# Altium project STM32F411CEU6.PrjPcb (part 2 of 3)
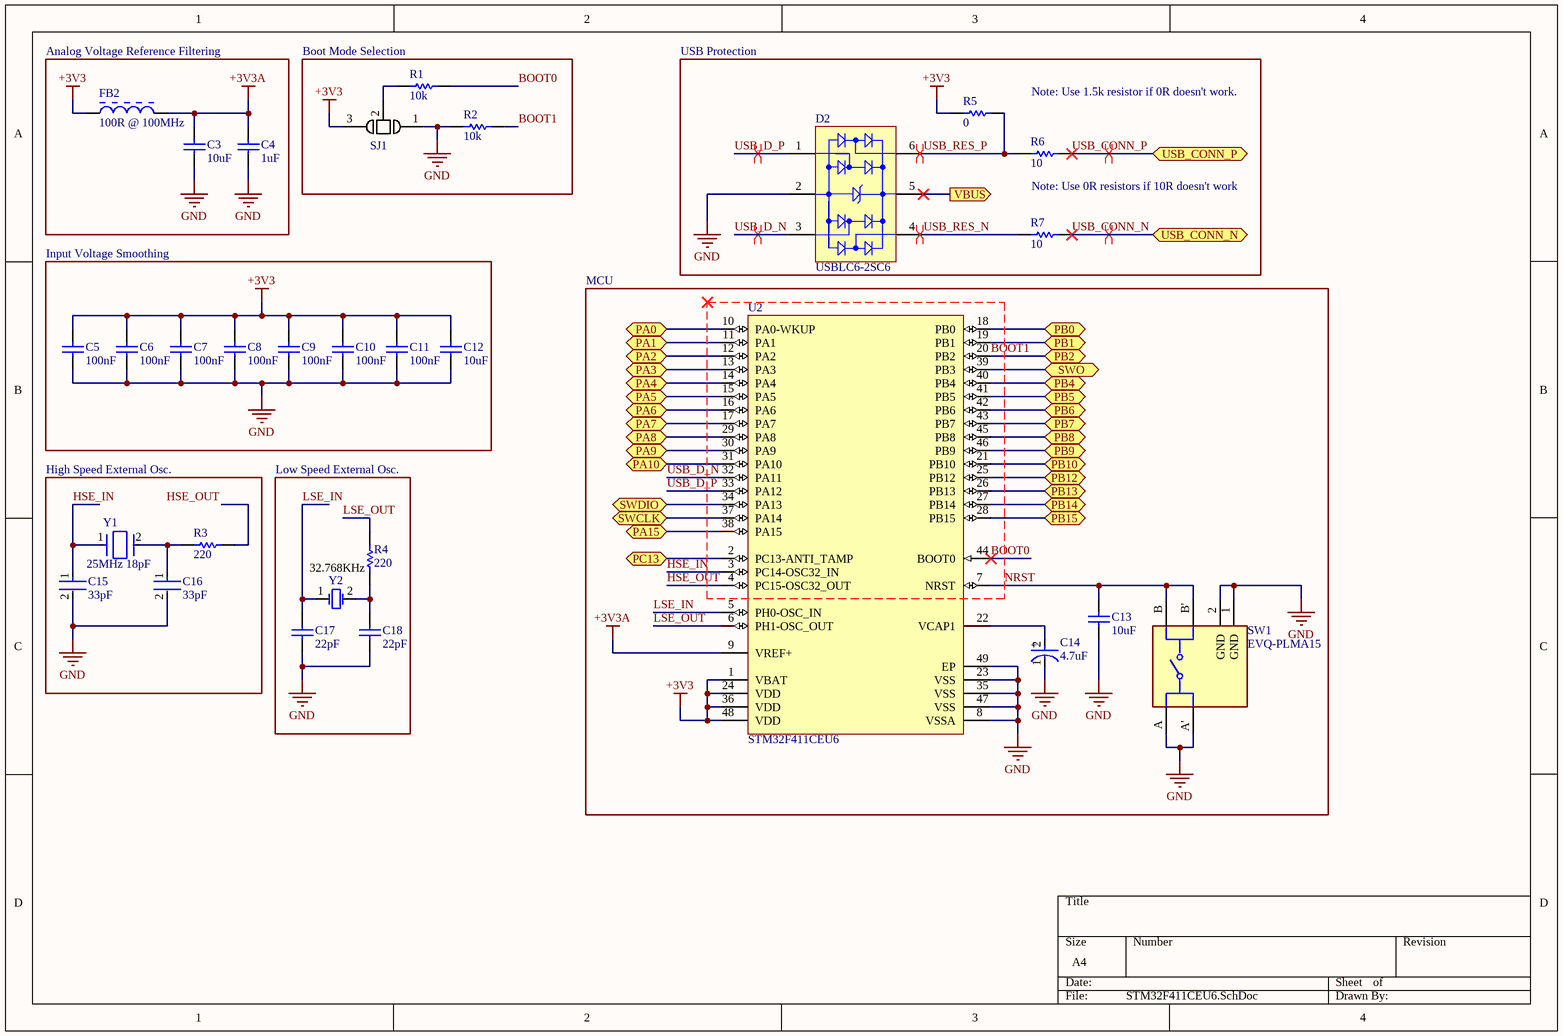
[diagram p1: STM32F411CEU6.SchDoc]

## Sheet STM32F411CEU6.SchDoc (continued)
### Library data of the parts
C3 C12 C13 = CMP-2000-06107-1: Chip Capacitor, 10 uF, +/- 10%, 25 V, -55 to 85 degC, 1206 (3216 Metric), RoHS, Tape and Reel; Manufacturer: Samsung Electro-Mechanics; Manufacturer Part Number: CL31A106KAHNNNE; Rated Voltage: 25V; Capacitance: 10µF; Dielectric: X5R; Material: Ceramic; Package Reference: 1206; Mounting Technology: SurfaceMount; Package Description: 2-Pin Surface Mount Device, Body 3.2 x 1.6 mm; Manufacturer URL: http://www.samsungsem.com/global/index.jsp; Case Size/Dimension: 1206; Datasheet URL: https://datasheet.ciiva.com/29201/452519-da-01-en-vs-kondensator-1206-29201124.pdf; Tolerance (%): ±10%; Datasheet Version: 11/2010; Supplier 1: Digi-Key; Supplier Part Number 1: 1276-1075-1-ND; RoHS: Yes; Category: Ceramic Capacitors; Stock 1: 396277; Pricing 1: 1=0.24000, 10=0.16500, 100=0.08360, 500=0.05720, 1000=0.05060 (USD); Mount: Surface Mount; Case/Package: 1206; Case Code (Metric): 3216; Case Code (Imperial): 1206; Contact Plating: Tin; Min Operating Temperature: -55°C; Max Operating Temperature: 85°C; Tolerance: 10%; Packaging: Tape and Reel; Voltage Rating (DC): 25V; Voltage Rating: 25V; Voltage: 25V; Length: 3.2mm; Height: 1.6mm; Width: 0.063inch; Depth: 1.6mm; Thickness: 0.071inch; Radiation Hardening: No; Lead Free: Lead Free; ComponentLink1URL: https://datasheet.ciiva.com/25710/cl31a106kahnnne-25710837.pdf?src-supplier=Digi-Key; ComponentLink1Description: https://datasheet.ciiva.com/25710/cl31a106kahnnne-25710837.pdf?src-supplier=Digi-Key; ComponentLink2URL: https://datasheet.ciiva.com/15195/getdatasheetpartid-355210-15195990.pdf?src-supplier=Verical; ComponentLink2Description: https://datasheet.ciiva.com/15195/getdatasheetpartid-355210-15195990.pdf?src-supplier=Verical; ComponentLink3URL: https://datasheet.ciiva.com/29201/452519-da-01-en-vs-kondensator-1206-29201124.pdf?src-supplier=Conrad; ComponentLink3Description: https://datasheet.ciiva.com/29201/452519-da-01-en-vs-kondensator-1206-29201124.pdf?src-supplier=Conrad; Supplier 2: LCSC; Supplier Part Number 2: C9807; Stock 2: 460; Pricing 2: 10=0.04400, 100=0.03140, 300=0.02920, 1000=0.02690, 5000=0.02540, 10000=0.02510, 10=0.04100, 100=0.02930, 300=0.02710, 1000=0.02500, 5000=0.02360, 10000=0.02340, 10=0.21300, 100=0.15210, 300=0.14120, 1000=0.13020, 5000=0.12290, 10000=0.12170, 10=0.19910, 100=0.14220, 300=0.13200, 1000=0.12170, 5000=0.11490, 10000=0.11380, 10=0.02670, 100=0.01910, 300=0.01770, 1000=0.01630, 5000=0.01540, 10000=0.01530, 10=0.02400, 100=0.01720, 300=0.01590, 1000=0.01470, 5000=0.01390, 10000=0.01370, 10=0.23290, 100=0.16630, 300=0.15440, 1000=0.14240, 5000=0.13440, 10000=0.13310, 10=3.22300, 100=2.30210, 300=2.13630, 1000=1.97060, 5000=1.86010, 10000=1.84170, 10=0.12870, 100=0.09190, 300=0.08530, 1000=0.07870, 5000=0.07430, 10000=0.07350, 10=2.09650, 100=1.49740, 300=1.38960, 1000=1.28180, 5000=1.21000, 10000=1.19800, 10=0.28100, 100=0.20070, 300=0.18620, 1000=0.17180, 5000=0.16220, 10000=0.16050, 10=0.04190, 100=0.02990, 300=0.02780, 1000=0.02560, 5000=0.02420, 10000=0.02390, 10=0.03005, 100=0.02146, 300=0.01992, 1000=0.01837, 5000=0.01734, 10000=0.01717 (AUD)
C4 = CMP-2007-03229-1: Part Number: C0805C105J4RACTU; Manufacturer: Kemet; Dielectric Material: Ceramic; Tolerance: 5%; Voltage Rating (DC): 16V; Dielectric: X7R; Supplier 1: Digi-Key; Supplier Part Number 1: 399-8001-1-ND; Manufacturer Part Number: C0805C105J4RACTU; RoHS: Yes; Category: Ceramic Capacitors; Stock 1: 85192; Pricing 1: 1=0.36000, 10=0.25000, 100=0.15030, 500=0.11272, 1000=0.09518 (USD); Mount: Surface Mount; Case/Package: 0805; Number of Pins: 2; Case Code (Imperial): 0805; Case Code (Metric): 2012; Min Operating Temperature: -55°C; Max Operating Temperature: 125°C; Capacitance: 1uF; Packaging: Tape and Reel; Package Quantity: 1; Termination: SMD/SMT; Voltage Rating: 16V; Length: 2mm; Height: 0.9mm; Width: 0.049inch; Thickness: 0.039inch; Depth: 1.25mm; Lead Pitch: 0.75mm; REACH SVHC: No SVHC; ComponentLink1URL: http://components.arrow.com/part/dataview/30748390S8976888N7429?src-supplier=Arrow; ComponentLink1Description: http://components.arrow.com/part/dataview/30748390S8976888N7429?src-supplier=Arrow; ComponentLink2URL: http://components.arrow.com/part/dataview/0323_00070888?src-supplier=Arrow+Europe; ComponentLink2Description: http://components.arrow.com/part/dataview/0323_00070888?src-supplier=Arrow+Europe; ComponentLink3URL: http://www.farnell.com/datasheets/2746093.pdf?src-supplier=Farnell; ComponentLink3Description: http://www.farnell.com/datasheets/2746093.pdf?src-supplier=Farnell; ComponentLink4URL: http://www.mouser.com/ds/2/212/KEM_C1002_X7R_SMD-1102033.pdf?src-supplier=Mouser; ComponentLink4Description: http://www.mouser.com/ds/2/212/KEM_C1002_X7R_SMD-1102033.pdf?src-supplier=Mouser; ComponentLink5URL: http://www.farnell.com/datasheets/2315440.pdf?src-supplier=Farnell; ComponentLink5Description: http://www.farnell.com/datasheets/2315440.pdf?src-supplier=Farnell; ComponentLink6URL: http://capacitoredge.kemet.com/capedge2/DataSheet?pn=C0805C105J4RACTU&src-supplier=Avnet; ComponentLink6Description: http://capacitoredge.kemet.com/capedge2/DataSheet?pn=C0805C105J4RACTU&src-supplier=Avnet; ComponentLink7URL: http://www.farnell.com/datasheets/1828800.pdf?src-supplier=Element14; ComponentLink7Description: http://www.farnell.com/datasheets/1828800.pdf?src-supplier=Element14; ComponentLink8URL: http://www.farnell.com/datasheets/1828800.pdf?src-supplier=Newark; ComponentLink8Description: http://www.farnell.com/datasheets/1828800.pdf?src-supplier=Newark; ComponentLink9URL: http://www.farnell.com/datasheets/2746093.pdf?src-supplier=Element14; ComponentLink9Description: http://www.farnell.com/datasheets/2746093.pdf?src-supplier=Element14; ComponentLink10URL: https://api.kemet.com/component-edge/download/datasheet/C0805C105J4RACTU.pdf?src-supplier=Digi-Key; ComponentLink10Description: https://api.kemet.com/component-edge/download/datasheet/C0805C105J4RACTU.pdf?src-supplier=Digi-Key; ComponentLink11URL: http://www.farnell.com/datasheets/2746093.pdf?src-supplier=Newark; ComponentLink11Description: http://www.farnell.com/datasheets/2746093.pdf?src-supplier=Newark; ComponentLink12URL: http://capacitoredge.kemet.com/capedge2/DataSheet?pn=C0805C105J4RACTU&src-supplier=Avnet+Europe; ComponentLink12Description: http://capacitoredge.kemet.com/capedge2/DataSheet?pn=C0805C105J4RACTU&src-supplier=Avnet+Europe
C5-C11 = CMP-2000-05808-1: Chip Capacitor, 0.1 uF, +/- 5%, 50 V, -55 to 125 degC, 0805 (2012 Metric), RoHS, Tape and Reel; Manufacturer Part Number: 08055C104JAT2A; Case Width: 1.25mm; Case Length: 2.01mm; Case Height: 0.94mm; Capacitance: 0.1uF; Brand: AVX; Type: StandardX7RMLCCs; Dissipation Factor DF: 2.5; Voltage Rating DC: 50V; Temperature Coefficient / Code: +/-15%; Capacitance - pF: 100000pF; Dielectric: X7R; Dielectric Material: Ceramic; Dissipation Factor: 2.5%; Insulation Resistance: 100GR; Dimensions: 1.25mmWx2.01mmLx0.94mmH; Product: GeneralTypeMLCCs; Package Description: 2-Pin Surface Mount Device, Body 2.01 x 1.25 mm; Package / Case: 0805(2012metric); Product Category: MultilayerCeramicCapacitorsMLCC-SMD/SMT; Case Code - mm: 2012; Packaging: Reel; Manufacturer URL: http://www.avx.com/; Operating Temperature Range: -55Cto+125C; Termination Style: SMD/SMT; Maximum Operating Temperature: +125C; Capacitance - nF: 100nF; Case Code - in: 0805; Minimum Operating Temperature: -55C; Factory Pack Quantity: 4000; RoHS: Details; Voltage Rating: 50V; Tolerance: 5%; Package Reference: 0805; Datasheet URL: http://www.farnell.com/datasheets/1679506.pdf; Manufacturer: AVX; Mounting Technology: SurfaceMount; Datasheet Version: 11/2012; Supplier 1: Digi-Key; Supplier Part Number 1: 478-3352-1-ND; Category: Ceramic Capacitors; Stock 1: 1860909; Pricing 1: 1=0.24000, 10=0.16500, 100=0.08360, 500=0.05722, 1000=0.05063 (USD); Mount: Surface Mount,PCB; Case/Package: 0805; Number of Pins: 2; Case Code (Metric): 2012; Case Code (Imperial): 0805; Contact Plating: Tin,Matte; Min Operating Temperature: -55°C; Max Operating Temperature: 125°C; Package Quantity: 1; Voltage Rating (DC): 50V; Termination: SMD/SMT; Voltage: 50V; Length: 2.01mm; Height: 0.94mm; Width: 0.049inch; Thickness: 0.037inch; Depth: 1.25mm; Radiation Hardening: No; REACH SVHC: No SVHC; Lead Free: Lead Free; ComponentLink1URL: https://datasheet.ciiva.com/27054/1929381-27054902.pdf?src-supplier=Jameco; ComponentLink1Description: https://datasheet.ciiva.com/27054/1929381-27054902.pdf?src-supplier=Jameco; ComponentLink2URL: https://datasheet.ciiva.com/150/cx7r-150563.pdf?src-supplier=Digi-Key; ComponentLink2Description: https://datasheet.ciiva.com/150/cx7r-150563.pdf?src-supplier=Digi-Key; ComponentLink3URL: https://datasheet.ciiva.com/150/cx7r-150564.pdf?src-supplier=Digi-Key; ComponentLink3Description: https://datasheet.ciiva.com/150/cx7r-150564.pdf?src-supplier=Digi-Key; ComponentLink4URL: https://datasheet.ciiva.com/150/cx7r-150565.pdf?src-supplier=Digi-Key; ComponentLink4Description: https://datasheet.ciiva.com/150/cx7r-150565.pdf?src-supplier=Digi-Key; ComponentLink5URL: https://datasheet.ciiva.com/28683/cx7r-28683529.pdf?src-supplier=Element14; ComponentLink5Description: https://datasheet.ciiva.com/28683/cx7r-28683529.pdf?src-supplier=Element14; ComponentLink6URL: https://datasheet.ciiva.com/7812/cx7r-7812074.pdf?src-supplier=Element14; ComponentLink6Description: https://datasheet.ciiva.com/7812/cx7r-7812074.pdf?src-supplier=Element14; ComponentLink7URL: https://datasheet.ciiva.com/7812/cx7r-7812075.pdf?src-supplier=Element14; ComponentLink7Description: https://datasheet.ciiva.com/7812/cx7r-7812075.pdf?src-supplier=Element14; ComponentLink8URL: https://datasheet.ciiva.com/15212/getdatasheetpartid-110198-15212571.pdf?src-supplier=Verical; ComponentLink8Description: https://datasheet.ciiva.com/15212/getdatasheetpartid-110198-15212571.pdf?src-supplier=Verical; ComponentLink9URL: https://datasheet.ciiva.com/7812/cx7r-7812076.pdf?src-supplier=Element14; ComponentLink9Description: https://datasheet.ciiva.com/7812/cx7r-7812076.pdf?src-supplier=Element14; ComponentLink10URL: https://datasheet.ciiva.com/14590/70001075-14590237.pdf?src-supplier=Allied+Electronics; ComponentLink10Description: https://datasheet.ciiva.com/14590/70001075-14590237.pdf?src-supplier=Allied+Electronics; ComponentLink11URL: https://datasheet.ciiva.com/16199/cx5r-16199661.pdf?src-supplier=Future+Electronics; ComponentLink11Description: https://datasheet.ciiva.com/16199/cx5r-16199661.pdf?src-supplier=Future+Electronics
C14 = CMP-04423-000002-1: CAP TANT POLY 4.7UF 10V SMD; Manufacturer Part Number: F381A475MMA; Manufacturer: AVX; Tolerance: 20%; Esr: 500mΩ; Material: Tantalum-Polymer; Ripple Current: 224mA; Dissipation Factor: 6%; Life: 1000Hours; Leakage Current: 10uA; ESR (Equivalent Series Resistance): 500mR; Package: F38M; Temperature Range High: +105°C; Temperature: -55°C to +105°C; ComponentLink2URL: http://datasheets.avx.com/F38.pdf; Mouser Description: Tantalum Capacitors - Polymer SMD 10volts 4.7uF 20%; Device Class L3: Polymer Capacitors; Lead Free: Yes; Temperature Range Low: -55°C; RoHS: TRUE; Capacitance: 4.7uF; Category: Cap; Footprint Url: http://www.avx.com/download/software/literature/AVX-Footprint-Library.pdf; Device Class L1: Passive Components; Voltage Rating: 10V; Octopart: https://octopart.com/f381a475mma-avx-30375031; ComponentLink2Description: Datasheet; Automotive: No; Digikey Description: CAP TANT POLY 4.7UF 10V SMD; Height: 0.9mm; Device Class L2: Capacitors; Value: 4.7uF; Supplier 1: Digi-Key; Supplier Part Number 1: 478-8726-1-ND; Stock 1: 1198; Pricing 1: 1=0.68000, 10=0.50200, 100=0.34440, 500=0.27268, 1000=0.22963 (USD); Mount: Surface Mount; Case/Package: 0603; Case Code (Metric): 1608; Case Code (Imperial): 0603; Min Operating Temperature: -55°C; Max Operating Temperature: 105°C; Voltage Rating (DC): 10V; Packaging: Cut Tape; Termination: SMD/SMT; Package Quantity: 1; Length: 1.6mm; Height - Seated (Max): 0.035inch; Width: 0.033inch; Depth: 0.85mm; Radiation Hardening: No; REACH SVHC: No SVHC; ComponentLink1URL: https://datasheet.ciiva.com/29504/f38-29504935.pdf?src-supplier=Digi-Key; ComponentLink1Description: https://datasheet.ciiva.com/29504/f38-29504935.pdf?src-supplier=Digi-Key; ComponentLink3URL: https://datasheet.ciiva.com/29897/f38-29897863.pdf?src-supplier=Avnet; ComponentLink3Description: https://datasheet.ciiva.com/29897/f38-29897863.pdf?src-supplier=Avnet; ComponentLink4URL: https://datasheet.ciiva.com/29504/f38-29504936.pdf?src-supplier=Digi-Key; ComponentLink4Description: https://datasheet.ciiva.com/29504/f38-29504936.pdf?src-supplier=Digi-Key; ComponentLink5URL: https://datasheet.ciiva.com/29504/f38-29504937.pdf?src-supplier=Digi-Key; ComponentLink5Description: https://datasheet.ciiva.com/29504/f38-29504937.pdf?src-supplier=Digi-Key; ComponentLink6URL: https://datasheet.ciiva.com/24040/f38-24040542.pdf?src-supplier=Mouser; ComponentLink6Description: https://datasheet.ciiva.com/24040/f38-24040542.pdf?src-supplier=Mouser
C15 C16 = CMP-13271-001471-1: Cap Ceramic 33pF 50V C0G ±5% SMD 0402 +125°C Paper T/R; Manufacturer: Samsung; Manufacturer Part Number: CL05C330JB5NNNC; Temperature Coefficient: 300ppm/°C; Dielectric: C0G; Height: 0.5mm; Tolerance: 5%; Package Quantity: 1; Mount: Surface Mount; Material: Ceramic; Min Operating Temperature: -55°C; Thickness: 0.022inch; Voltage Rating (DC): 50V; Case/Package: 0402; Width: 0.02inch; Depth: 0.5mm; Lead Free: Lead Free; Max Operating Temperature: 125°C; Voltage: 50V; Case Code (Metric): 1005; Capacitance: 33pF; Case Code (Imperial): 0402; Packaging: Tape and Reel; Voltage Rating: 50V; Contact Plating: Tin; Radiation Hardening: No; Length: 1mm; Supplier 1: LCSC; Supplier Part Number 1: C70465; RoHS: Yes; Category: Ceramic Capacitors; Stock 1: 118300; Pricing 1: 100=0.00330, 1000=0.00240, 3000=0.00230, 10000=0.00210, 50000=0.00210, 100000=0.00200, 100=0.00310, 1000=0.00230, 3000=0.00220, 10000=0.00200, 50000=0.00200, 100000=0.00190, 100=0.01640, 1000=0.01220, 3000=0.01140, 10000=0.01060, 50000=0.01030, 100000=0.01010, 100=0.01490, 1000=0.01110, 3000=0.01040, 10000=0.00970, 50000=0.00930, 100000=0.00920, 100=0.00200, 1000=0.00150, 3000=0.00140, 10000=0.00130, 50000=0.00130, 100000=0.00120, 100=0.00180, 1000=0.00140, 3000=0.00130, 10000=0.00120, 50000=0.00110, 100000=0.00110, 100=0.01810, 1000=0.01350, 3000=0.01260, 10000=0.01180, 50000=0.01140, 100000=0.01120, 100=0.24740, 1000=0.18370, 3000=0.17200, 10000=0.16030, 50000=0.15520, 100000=0.15250, 100=0.01000, 1000=0.00740, 3000=0.00690, 10000=0.00650, 50000=0.00620, 100000=0.00610, 100=0.16780, 1000=0.12460, 3000=0.11660, 10000=0.10870, 50000=0.10520, 100000=0.10340, 100=0.02060, 1000=0.01530, 3000=0.01430, 10000=0.01340, 50000=0.01290, 100000=0.01270, 100=0.00320, 1000=0.00240, 3000=0.00220, 10000=0.00210, 50000=0.00200, 100000=0.00200, 100=0.00234, 1000=0.00174, 3000=0.00163, 10000=0.00152, 50000=0.00147, 100000=0.00144 (AUD); ComponentLink1URL: https://datasheet.ciiva.com/15195/getdatasheetpartid-355282-15195687.pdf?src-supplier=Verical; ComponentLink1Description: https://datasheet.ciiva.com/15195/getdatasheetpartid-355282-15195687.pdf?src-supplier=Verical; ComponentLink2URL: https://datasheet.ciiva.com/29198/458594-da-01-en-vs-kondensator-0402-29198402.pdf?src-supplier=Conrad; ComponentLink2Description: https://datasheet.ciiva.com/29198/458594-da-01-en-vs-kondensator-0402-29198402.pdf?src-supplier=Conrad; Supplier 2: Digi-Key; Supplier Part Number 2: 1276-1272-1-ND; Stock 2: 9451353; Pricing 2: 1=0.10000, 10=0.02700, 50=0.01460, 100=0.01200, 500=0.00854, 1000=0.00672, 2500=0.00610, 5000=0.00562 (USD)
C17 C18 = CMP-2007-00048-1: Manufacturer: Kemet; Part Number: C0805C220J5GACTU; Dielectric Material: Ceramic; Tolerance: 5%; Dielectric: C0G; Voltage Rating: 50V; Temperature Coefficient: 30ppm/°C; Supplier 1: Digi-Key; Supplier Part Number 1: 399-1113-1-ND; Manufacturer Part Number: C0805C220J5GACTU; RoHS: Yes; Category: Ceramic Capacitors; Stock 1: 508600; Pricing 1: 1=0.10000, 10=0.07000, 100=0.03100, 500=0.02214, 1000=0.01739 (USD); Mount: PCB,Surface Mount; Case/Package: 0805; Weight: 0.000194oz; Case Code (Metric): 2012; Case Code (Imperial): 0805; Contact Plating: Tin,Matte; Contact Material: Tin; Min Operating Temperature: -55°C; Max Operating Temperature: 125°C; Packaging: Tape and Reel; Capacitance: 22pF; Voltage Rating (DC): 50V; Package Quantity: 1; Termination: SMD/SMT; Voltage: 50V; Length: 2mm; Height: 0.78mm; Width: 1.25mm; Depth: 1.25mm; Thickness: 0.035inch; Radiation Hardening: No; REACH SVHC: No SVHC; Lead Free: Lead Free; ComponentLink1URL: https://datasheet.ciiva.com/7842/1732694-7842250.pdf?src-supplier=Element14; ComponentLink1Description: https://datasheet.ciiva.com/7842/1732694-7842250.pdf?src-supplier=Element14; ComponentLink2URL: https://datasheet.ciiva.com/7842/kem-c1003-c0g-smd-7842569.pdf?src-supplier=Element14; ComponentLink2Description: https://datasheet.ciiva.com/7842/kem-c1003-c0g-smd-7842569.pdf?src-supplier=Element14; ComponentLink3URL: https://datasheet.ciiva.com/28668/1789732-28668761.pdf?src-supplier=Element14; ComponentLink3Description: https://datasheet.ciiva.com/28668/1789732-28668761.pdf?src-supplier=Element14; ComponentLink4URL: https://datasheet.ciiva.com/7842/1372242-7842570.pdf?src-supplier=Element14; ComponentLink4Description: https://datasheet.ciiva.com/7842/1372242-7842570.pdf?src-supplier=Element14; ComponentLink5URL: https://datasheet.ciiva.com/7842/1732694-7842251.pdf?src-supplier=Element14; ComponentLink5Description: https://datasheet.ciiva.com/7842/1732694-7842251.pdf?src-supplier=Element14
D2 = CMP-2000-05378-1: Very low capacitance ESD protection, 3.5 pF, -40 to 125 degC, 6-Pin SOT23, RoHS, Tape and Reel; Manufacturer: STMicroelectronics; Polarity: Uni-Directional; Clamping Voltage: 17V; Rad Hardened: No; Product Height (mm): 1.3mm; Leakage Current (Max): 0.15uA; Product Length (mm): 3.05mm; Number of Elements: 1; Peak Pulse Current: 5A; Configuration: Dual; Reverse Breakdown Voltage: 6V; Working Voltage (Max): 5V; Capacitance Value: 3.5pF; Suppressor Type: DiodeArrays; Product Depth (mm): 1.75mm; Test Current (It): 1mA; Data Rate: 480Mbps; Direction: Unidirectional,Bidirectional; Operating Supply Voltage: 1.1V; Number of Channels: 2; Reverse Standoff Voltage: 5.25V; Power Line Protection: Yes; Max Reverse Leakage Current: 150nA; Package / Case: SOT-23; Operating Temperature Max Deg. C: 125C; Package Description: 6-Pin Small Outline Transistor, Body 2.925 x 1.625 mm, Pitch 0.95 mm; Package Reference: SOT23-6L; Datasheet Version: Rev. 5, 10/2011; Operating Temperature Min Deg. C: -40C; Mounting Style: SurfaceMount; Direction Type: Uni-Directional; Mounting: SurfaceMount; Pin Count: 6; Leakage Current: 0.15uA; Packaging: TapeandReel; Operating Temperature Classification: Automotive; Clamping Voltage (Max): 17V; Manufacturer URL: http://www.st.com/; Reverse Stand-off Voltage: 5V; Datasheet URL: http://www.st.com/st-web-ui/static/active/en/resource/technical/document/datasheet/CD00050750.pdf; Working Voltage: 5V; Operating Temp Range: -40Cto125C; Supplier 1: LCSC; Supplier Part Number 1: C7519; Manufacturer Part Number: USBLC6-2SC6; RoHS: Yes; Category: TVS Diodes; Stock 1: 134230; Pricing 1: 5=0.11390, 50=0.08290, 150=0.07720, 500=0.07160, 2500=0.06900, 5000=0.06780, 5=0.10900, 50=0.07940, 150=0.07400, 500=0.06850, 2500=0.06610, 5000=0.06490, 5=0.57160, 50=0.41630, 150=0.38780, 500=0.35930, 2500=0.34660, 5000=0.34030, 5=0.51650, 50=0.37620, 150=0.35040, 500=0.32460, 2500=0.31320, 5000=0.30750, 5=0.06940, 50=0.05050, 150=0.04710, 500=0.04360, 2500=0.04210, 5000=0.04130, 5=0.06290, 50=0.04580, 150=0.04270, 500=0.03960, 2500=0.03820, 5000=0.03750, 5=0.63310, 50=0.46110, 150=0.42950, 500=0.39790, 2500=0.38390, 5000=0.37700, 5=8.58430, 50=6.25210, 150=5.82360, 500=5.39530, 2500=5.20490, 5000=5.11090, 5=0.34660, 50=0.25240, 150=0.23510, 500=0.21780, 2500=0.21010, 5000=0.20630, 5=5.93360, 50=4.32150, 150=4.02540, 500=3.72930, 2500=3.59770, 5000=3.53270, 5=0.71370, 50=0.51980, 150=0.48420, 500=0.44860, 2500=0.43270, 5000=0.42490, 5=0.11230, 50=0.08180, 150=0.07620, 500=0.07060, 2500=0.06810, 5000=0.06690, 5=0.08169, 50=0.05950, 150=0.05542, 500=0.05135, 2500=0.04953, 5000=0.04864 (AUD); Mount: Surface Mount; Case/Package: SOT-23; Number of Pins: 6; Contact Plating: Tin,Matte; Min Operating Temperature: -40°C; Max Operating Temperature: 125°C; Capacitance: 3.5pF; Package Quantity: 3000; Breakdown Voltage: 6V; Termination: SMD/SMT; Number of Bidirectional Channels: 2; Min Breakdown Voltage: 6V; ESD Protection: Yes; Test Current: 1mA; Max Breakdown Voltage: 6V; Element Configuration: Dual; Length: 3.05mm; Height: 1.3mm; Width: 1.75mm; Depth: 1.75mm; Radiation Hardening: No; REACH SVHC: No SVHC; Lead Free: Lead Free; ComponentLink1URL: https://datasheet.ciiva.com/1268/1690354-1268384.pdf?src-supplier=Element14; ComponentLink1Description: https://datasheet.ciiva.com/1268/1690354-1268384.pdf?src-supplier=Element14; ComponentLink2URL: https://datasheet.ciiva.com/4508/cd00050750-113117-4508433.pdf?src-supplier=Mouser; ComponentLink2Description: https://datasheet.ciiva.com/4508/cd00050750-113117-4508433.pdf?src-supplier=Mouser; ComponentLink3URL: https://datasheet.ciiva.com/26787/usblc6-2sc6-26787908.pdf?src-supplier=IIIC; ComponentLink3Description: https://datasheet.ciiva.com/26787/usblc6-2sc6-26787908.pdf?src-supplier=IIIC; ComponentLink4URL: https://datasheet.ciiva.com/16200/cd00050750-16200026.pdf?src-supplier=Future+Electronics; ComponentLink4Description: https://datasheet.ciiva.com/16200/cd00050750-16200026.pdf?src-supplier=Future+Electronics; Supplier 2: Digi-Key; Supplier Part Number 2: 497-5235-1-ND; Stock 2: 75819; Pricing 2: 1=0.45000, 10=0.38800, 25=0.36200, 100=0.26880, 500=0.20990, 1000=0.17061 (USD)
FB2 = CMP-0686-00557-6: Chip Ferrite Bead for Power Lines, 120 Ohm, 2000 mA, -55 to 125 degC, 1.6 x 0.8 x 0.95 mm SMD, Tape and Reel; PartNumber: BLM18PG121SN1D; Manufacturer: Murata; Impedance (at 100 MHz): 120 Ohm +/- 25%; Rated Current: 2000 mA; DC Resistance: 0.05 Ohm Max.; Description: MURATA - BLM18PG121SN1D - FERRITE, BEAD, 0603, 0.05OHM, 2A; Material: Steel,Ferrite; Impedance: 120R; Current Rating: 2A; DC Resistance (DCR): 50mR; Number of Lines: 1; Tolerance: 25%; Shielding: Unshielded; DatasheetVersion: 08/2013; PackageDescription: 2-Pin Chip, Body 1.6 x 0.8 mm; ComponentLink3URL: http://www.murata.com/products/catalog/pdf/c31e.pdf; ComponentLink1URL: http://www.murata.com/; ComponentLink2Description: Datasheet; Mounting Technology: Surface Mount; ComponentLink1Description: Manufacturer URL; PackageReference: BLM18_H950-2; ComponentLink2URL: http://www.murata.com/products/catalog/pdf/c31e.pdf; ComponentLink3Description: Package Specification; Packing: Tape and Reel; Operating Temperature Range: -55 to 125 degC; Supplier 1: LCSC; Supplier Part Number 1: C14709; Manufacturer Part Number: BLM18PG121SN1D; RoHS: Yes; Category: Inductors; Stock 1: 101650; Pricing 1: 50=0.01390, 500=0.01020, 1500=0.00950, 5000=0.00880, 25000=0.00850, 50000=0.00840, 50=0.01320, 500=0.00970, 1500=0.00910, 5000=0.00840, 25000=0.00810, 50000=0.00800, 50=0.06740, 500=0.04940, 1500=0.04610, 5000=0.04280, 25000=0.04130, 50000=0.04060, 50=0.06270, 500=0.04600, 1500=0.04290, 5000=0.03980, 25000=0.03850, 50000=0.03780, 50=0.00840, 500=0.00620, 1500=0.00580, 5000=0.00540, 25000=0.00520, 50000=0.00510, 50=0.00770, 500=0.00560, 1500=0.00530, 5000=0.00490, 25000=0.00470, 50000=0.00460, 50=0.07670, 500=0.05620, 1500=0.05250, 5000=0.04870, 25000=0.04700, 50000=0.04620, 50=1.04540, 500=0.76650, 1500=0.71530, 5000=0.66410, 25000=0.64130, 50000=0.63000, 50=0.04110, 500=0.03010, 1500=0.02810, 5000=0.02610, 25000=0.02520, 50000=0.02480, 50=0.78020, 500=0.57200, 1500=0.53390, 5000=0.49560, 25000=0.47870, 50000=0.47020, 50=0.08860, 500=0.06500, 1500=0.06070, 5000=0.05630, 25000=0.05440, 50000=0.05340, 50=0.01350, 500=0.00990, 1500=0.00930, 5000=0.00860, 25000=0.00830, 50000=0.00820, 50=0.00989, 500=0.00725, 1500=0.00677, 5000=0.00628, 25000=0.00607, 50000=0.00596 (AUD); Case/Package: 0603; Number of Pins: 2; Case Code (Metric): 1608; Case Code (Imperial): 0603; Core Material: Ferrite; Min Operating Temperature: -55°C; Max Operating Temperature: 125°C; Package Quantity: 1; Packaging: Tape and Reel; Max DC Current: 2A; Termination: SMD/SMT; Test Frequency: 100MHz; Frequency: 100MHz; Max Current Rating: 2A; DC Current: 2A; Number of Circuits: 1; Length: 1.6mm; Height: 0.8mm; Width: 0.8mm; Depth: 0.8mm; Radiation Hardening: No; REACH SVHC: No SVHC; Lead Free: Lead Free; ComponentLink4URL: https://datasheet.ciiva.com/5709/1740433-5709171.pdf?src-supplier=Farnell; ComponentLink4Description: https://datasheet.ciiva.com/5709/1740433-5709171.pdf?src-supplier=Farnell; ComponentLink5URL: https://datasheet.ciiva.com/11799/0900766b81275ca5-11799546.pdf?src-supplier=RSComponents; ComponentLink5Description: https://datasheet.ciiva.com/11799/0900766b81275ca5-11799546.pdf?src-supplier=RSComponents; ComponentLink6URL: https://datasheet.ciiva.com/19454/1845013-19454715.pdf?src-supplier=Jameco; ComponentLink6Description: https://datasheet.ciiva.com/19454/1845013-19454715.pdf?src-supplier=Jameco; ComponentLink7URL: https://datasheet.ciiva.com/3854/5emiapbde-1-3854039.pdf?src-supplier=Arrow+Electronics; ComponentLink7Description: https://datasheet.ciiva.com/3854/5emiapbde-1-3854039.pdf?src-supplier=Arrow+Electronics; ComponentLink8URL: https://datasheet.ciiva.com/29347/442365-da-01-en-chip-drossel-0603-120r-2000ma-1-6x0-8mm-29347911.pdf?src-supplier=Conrad; ComponentLink8Description: https://datasheet.ciiva.com/29347/442365-da-01-en-chip-drossel-0603-120r-2000ma-1-6x0-8mm-29347911.pdf?src-supplier=Conrad; ComponentLink9URL: https://datasheet.ciiva.com/3081/l0110s0100blm18p-3081632.pdf?src-supplier=Avnet; ComponentLink9Description: https://datasheet.ciiva.com/3081/l0110s0100blm18p-3081632.pdf?src-supplier=Avnet; ComponentLink10URL: https://datasheet.ciiva.com/8021/1740433-8021493.pdf?src-supplier=Element14; ComponentLink10Description: https://datasheet.ciiva.com/8021/1740433-8021493.pdf?src-supplier=Element14; ComponentLink11URL: https://datasheet.ciiva.com/6212/l0110s0100blm18p-6212502.pdf?src-supplier=Digi-Key; ComponentLink11Description: https://datasheet.ciiva.com/6212/l0110s0100blm18p-6212502.pdf?src-supplier=Digi-Key; ComponentLink12URL: https://datasheet.ciiva.com/8021/1740433-8021494.pdf?src-supplier=Element14; ComponentLink12Description: https://datasheet.ciiva.com/8021/1740433-8021494.pdf?src-supplier=Element14; ComponentLink13URL: https://datasheet.ciiva.com/6212/l0110s0100blm18p-6212504.pdf?src-supplier=Digi-Key; ComponentLink13Description: https://datasheet.ciiva.com/6212/l0110s0100blm18p-6212504.pdf?src-supplier=Digi-Key; ComponentLink14URL: https://datasheet.ciiva.com/14122/blm-series-eng-tds-14122905.pdf?src-supplier=Distrelec; ComponentLink14Description: https://datasheet.ciiva.com/14122/blm-series-eng-tds-14122905.pdf?src-supplier=Distrelec; ComponentLink15URL: https://datasheet.ciiva.com/25903/l0110s0100blm18p-25903483.pdf?src-supplier=Avnet+Europe; ComponentLink15Description: https://datasheet.ciiva.com/25903/l0110s0100blm18p-25903483.pdf?src-supplier=Avnet+Europe; ComponentLink16URL: https://datasheet.ciiva.com/41449/001172297-da-01-en-drossel-0603-120r-1-6x0-8mm-4000st-41449659.pdf?src-supplier=Conrad; ComponentLink16Description: https://datasheet.ciiva.com/41449/001172297-da-01-en-drossel-0603-120r-1-6x0-8mm-4000st-41449659.pdf?src-supplier=Conrad; Supplier 2: Digi-Key; Supplier Part Number 2: 490-1037-1-ND; Stock 2: 652829; Pricing 2: 1=0.10000, 10=0.07600, 25=0.06920, 50=0.06220, 100=0.04550, 250=0.03312, 500=0.03036, 1000=0.02622 (USD)
R1 R2 = CMP-2001-00337-1: Part Number: ERJ-6GEYJ103V; Manufacturer: Panasonic; Resistance: 10kR; Power Rating: 125mW; Voltage Rating: 150V; Temperature Coefficient: 200ppm/°C; Tolerance: 5%; Supplier 1: Digi-Key; Supplier Part Number 1: P10KACT-ND; Manufacturer Part Number: ERJ-6GEYJ103V; RoHS: Yes; Category: Chip SMD Resistors; Stock 1: 4163299; Pricing 1: 1=0.10000, 10=0.05400, 100=0.02210, 1000=0.00991, 2500=0.00860 (USD); Mount: Surface Mount; Case/Package: 0805; Case Code (Metric): 2012; Case Code (Imperial): 0805; Contact Plating: Tin; Min Operating Temperature: -55°C; Max Operating Temperature: 155°C; Packaging: Tape and Reel; Termination: SMD/SMT; Composition: Thick Film; Voltage Rating (DC): 150V; Package Quantity: 5000; Number of Terminations: 2; Military Standard: Not; Max Power Dissipation: 125mW; Features: Automotive AEC-Q200; Length: 2mm; Height: 0.6mm; Width: 0.049inch; Depth: 1.25mm; Radiation Hardening: No; Lead Free: Lead Free; REACH SVHC: No SVHC; ComponentLink1URL: https://datasheet.ciiva.com/11821/0900766b80f806dd-11821504.pdf?src-supplier=RSComponents; ComponentLink1Description: https://datasheet.ciiva.com/11821/0900766b80f806dd-11821504.pdf?src-supplier=RSComponents; ComponentLink2URL: https://datasheet.ciiva.com/22785/1500035-22785957.pdf?src-supplier=Farnell; ComponentLink2Description: https://datasheet.ciiva.com/22785/1500035-22785957.pdf?src-supplier=Farnell; ComponentLink3URL: https://datasheet.ciiva.com/30128/4aoa0000ce1-30128839.pdf?src-supplier=Onlinecomponents.com; ComponentLink3Description: https://datasheet.ciiva.com/30128/4aoa0000ce1-30128839.pdf?src-supplier=Onlinecomponents.com; ComponentLink4URL: https://datasheet.ciiva.com/16428/aoa0000ce1-16428072.pdf?src-supplier=Future+Electronics; ComponentLink4Description: https://datasheet.ciiva.com/16428/aoa0000ce1-16428072.pdf?src-supplier=Future+Electronics; ComponentLink5URL: https://datasheet.ciiva.com/16782/70255313-16782712.pdf?src-supplier=Allied+Electronics; ComponentLink5Description: https://datasheet.ciiva.com/16782/70255313-16782712.pdf?src-supplier=Allied+Electronics; ComponentLink6URL: https://datasheet.ciiva.com/43460/1500035-43460125.pdf?src-supplier=Farnell; ComponentLink6Description: https://datasheet.ciiva.com/43460/1500035-43460125.pdf?src-supplier=Farnell; ComponentLink7URL: https://datasheet.ciiva.com/17212/aoa0000ce1-17212110.pdf?src-supplier=Avnet+Europe; ComponentLink7Description: https://datasheet.ciiva.com/17212/aoa0000ce1-17212110.pdf?src-supplier=Avnet+Europe; ComponentLink8URL: https://datasheet.ciiva.com/16787/70255313-16787775.pdf?src-supplier=Allied+Electronics; ComponentLink8Description: https://datasheet.ciiva.com/16787/70255313-16787775.pdf?src-supplier=Allied+Electronics; ComponentLink9URL: https://datasheet.ciiva.com/46386/1500035-46386469.pdf?src-supplier=Element14; ComponentLink9Description: https://datasheet.ciiva.com/46386/1500035-46386469.pdf?src-supplier=Element14; ComponentLink10URL: https://datasheet.ciiva.com/9117/aoa0000ce1-9117371.pdf?src-supplier=Avnet; ComponentLink10Description: https://datasheet.ciiva.com/9117/aoa0000ce1-9117371.pdf?src-supplier=Avnet; ComponentLink11URL: https://datasheet.ciiva.com/28514/1678796-28514236.pdf?src-supplier=Element14; ComponentLink11Description: https://datasheet.ciiva.com/28514/1678796-28514236.pdf?src-supplier=Element14; Supplier 2: LCSC; Supplier Part Number 2: C180849; Stock 2: 85650; Pricing 2: 50=0.01010, 500=0.00750, 1500=0.00700, 5000=0.00650, 25000=0.00630, 50000=0.00620, 50=0.00940, 500=0.00700, 1500=0.00650, 5000=0.00600, 25000=0.00580, 50000=0.00570, 50=0.04910, 500=0.03630, 1500=0.03390, 5000=0.03150, 25000=0.03050, 50000=0.03000, 50=0.04600, 500=0.03390, 1500=0.03170, 5000=0.02950, 25000=0.02850, 50000=0.02800, 50=0.00620, 500=0.00460, 1500=0.00430, 5000=0.00400, 25000=0.00380, 50000=0.00380, 50=0.00550, 500=0.00410, 1500=0.00380, 5000=0.00350, 25000=0.00340, 50000=0.00340, 50=0.05370, 500=0.03960, 1500=0.03700, 5000=0.03450, 25000=0.03330, 50000=0.03280, 50=0.73950, 500=0.54590, 1500=0.51040, 5000=0.47480, 25000=0.45900, 50000=0.45120, 50=0.02970, 500=0.02190, 1500=0.02050, 5000=0.01900, 25000=0.01840, 50000=0.01810, 50=0.48310, 500=0.35660, 1500=0.33340, 5000=0.31020, 25000=0.29980, 50000=0.29470, 50=0.06470, 500=0.04780, 1500=0.04470, 5000=0.04160, 25000=0.04020, 50000=0.03950, 50=0.00970, 500=0.00710, 1500=0.00670, 5000=0.00620, 25000=0.00600, 50000=0.00590, 50=0.00693, 500=0.00511, 1500=0.00478, 5000=0.00445, 25000=0.00430, 50000=0.00423 (AUD)
R3 R4 = CMP-2001-00044-1: Part Number: ERJ6ENF2200V; Manufacturer: Panasonic; Manufacturer Part Number: ERJ-6ENF2200V; Resistance: 220R; Tolerance: 1%; Temperature Coefficient: 100ppm/°C; Power Rating: 125mW; Voltage Rating: 150V; Supplier 1: Digi-Key; Supplier Part Number 1: P220CCT-ND; RoHS: Yes; Category: Chip SMD Resistors; Stock 1: 108553; Pricing 1: 1=0.10000, 10=0.07200, 100=0.02750, 1000=0.01210, 2500=0.01045 (USD); Mount: Surface Mount; Case/Package: 0805; Number of Pins: 2; Case Code (Imperial): 0805; Case Code (Metric): 2012; Contact Plating: Tin; Min Operating Temperature: -55°C; Max Operating Temperature: 155°C; Packaging: Tape and Reel; Composition: Thick Film; Termination: SMD/SMT; Voltage Rating (DC): 150V; Package Quantity: 1; Number of Terminations: 2; Max Power Dissipation: 125mW; Military Standard: Not; Features: Automotive AEC-Q200; Length: 2mm; Height: 0.6mm; Width: 1.2mm; Depth: 1.25mm; Radiation Hardening: No; Lead Free: Lead Free; REACH SVHC: No SVHC; ComponentLink1URL: https://datasheet.ciiva.com/11821/0900766b80f80784-11821561.pdf?src-supplier=RSComponents; ComponentLink1Description: https://datasheet.ciiva.com/11821/0900766b80f80784-11821561.pdf?src-supplier=RSComponents; ComponentLink2URL: https://datasheet.ciiva.com/26914/getdatasheetpartid-123856-26914677.pdf?src-supplier=Verical; ComponentLink2Description: https://datasheet.ciiva.com/26914/getdatasheetpartid-123856-26914677.pdf?src-supplier=Verical; ComponentLink3URL: https://datasheet.ciiva.com/43511/aoa0000ce2-43511461.pdf?src-supplier=Onlinecomponents.com; ComponentLink3Description: https://datasheet.ciiva.com/43511/aoa0000ce2-43511461.pdf?src-supplier=Onlinecomponents.com; ComponentLink4URL: https://datasheet.ciiva.com/7887/426256-7887031.pdf?src-supplier=Element14; ComponentLink4Description: https://datasheet.ciiva.com/7887/426256-7887031.pdf?src-supplier=Element14; ComponentLink5URL: https://datasheet.ciiva.com/28568/1678782-28568983.pdf?src-supplier=Element14; ComponentLink5Description: https://datasheet.ciiva.com/28568/1678782-28568983.pdf?src-supplier=Element14; ComponentLink6URL: https://datasheet.ciiva.com/16771/70260748-16771368.pdf?src-supplier=Allied+Electronics; ComponentLink6Description: https://datasheet.ciiva.com/16771/70260748-16771368.pdf?src-supplier=Allied+Electronics; ComponentLink7URL: https://datasheet.ciiva.com/16784/70260748-16784746.pdf?src-supplier=Allied+Electronics; ComponentLink7Description: https://datasheet.ciiva.com/16784/70260748-16784746.pdf?src-supplier=Allied+Electronics; ComponentLink8URL: https://datasheet.ciiva.com/22668/1678782-22668331.pdf?src-supplier=Element14; ComponentLink8Description: https://datasheet.ciiva.com/22668/1678782-22668331.pdf?src-supplier=Element14; ComponentLink9URL: https://datasheet.ciiva.com/9184/aoa0000ce2-9184302.pdf?src-supplier=Avnet; ComponentLink9Description: https://datasheet.ciiva.com/9184/aoa0000ce2-9184302.pdf?src-supplier=Avnet; Supplier 2: LCSC; Supplier Part Number 2: C413269; Stock 2: 1550; Pricing 2: 50=0.01470, 500=0.01080, 1500=0.01000, 5000=0.00930, 25000=0.00900, 50000=0.00880, 50=0.01370, 500=0.01000, 1500=0.00940, 5000=0.00870, 25000=0.00840, 50000=0.00820, 50=0.07160, 500=0.05230, 1500=0.04880, 5000=0.04530, 25000=0.04370, 50000=0.04290, 50=0.06700, 500=0.04900, 1500=0.04570, 5000=0.04240, 25000=0.04090, 50000=0.04020, 50=0.00900, 500=0.00660, 1500=0.00610, 5000=0.00570, 25000=0.00550, 50000=0.00540, 50=0.00810, 500=0.00590, 1500=0.00550, 5000=0.00510, 25000=0.00490, 50000=0.00480, 50=0.07830, 500=0.05720, 1500=0.05330, 5000=0.04950, 25000=0.04780, 50000=0.04690, 50=1.07840, 500=0.78820, 1500=0.73490, 5000=0.68170, 25000=0.65790, 50000=0.64620, 50=0.04320, 500=0.03160, 1500=0.02950, 5000=0.02730, 25000=0.02640, 50000=0.02590, 50=0.70440, 500=0.51490, 1500=0.48010, 5000=0.44530, 25000=0.42980, 50000=0.42210, 50=0.09440, 500=0.06900, 1500=0.06430, 5000=0.05970, 25000=0.05760, 50000=0.05660, 50=0.01410, 500=0.01030, 1500=0.00960, 5000=0.00890, 25000=0.00860, 50000=0.00840, 50=0.01010, 500=0.00738, 1500=0.00688, 5000=0.00638, 25000=0.00616, 50000=0.00605 (AUD)
R5 = CMP-1665-00002-5: Chip Resistor, 0 Ohm, +/- 1%, 0.125 W, -55 to 155 degC, 0805 (2012 Metric), RoHS, Tape and Reel; PartNumber: ERJ-6GEY0R00V; Manufacturer: Panasonic; Tolerance: 5%; Resistance: 0 Ohm; Max Power Dissipation: 125mW; Voltage Rating: 150V; Temperature Coefficient: 600ppm/°C; Current Rating: 2A; REACH SVHC: No SVHC; Min Operating Temperature: -55 degC; Case/Package: 0805; Packaging: Tape and Reel; Package Quantity: 5000; ComponentLink1Description: Manufacturer URL; PackageDescription: 2-Pin Surface Mount Device, Body 2 x 1.25 mm; Mounting Technology: Surface Mount; Max Operating Temperature: 155 degC; Width: 1.25 mm; RoHSCompliant: True; Height: 0.6 mm; ComponentLink1URL: http://www.panasonic.com/; ComponentLink2URL: http://industrial.panasonic.com/cdbs/www-data/pdf/RDA0000/AOA0000C84.pdf; Case Code (Imperial): 0805; DatasheetVersion: 03/2015; Length: 2 mm; Case Code (Metric): 2012; ComponentLink2Description: Datasheet; Radiation Hardening: No; Supplier 1: Digi-Key; Supplier Part Number 1: P0.0ACT-ND; Manufacturer Part Number: ERJ-6GEY0R00V; RoHS: Yes; Category: Chip SMD Resistors; Stock 1: 2204349; Pricing 1: 1=0.10000, 10=0.05200, 25=0.03800, 50=0.02880, 100=0.02120, 250=0.01620, 500=0.01296, 1000=0.00954 (USD); Mount: Surface Mount; Contact Plating: Tin; Composition: Thick Film; Number of Terminations: 2; Power Rating: 125mW; Military Standard: Not; Voltage Rating (DC): 150V; Termination: SMD/SMT; Features: Automotive AEC-Q200; Depth: 1.25mm; Lead Free: Lead Free; ComponentLink3URL: https://datasheet.ciiva.com/11821/0900766b80f806dd-11821735.pdf?src-supplier=RSComponents; ComponentLink3Description: https://datasheet.ciiva.com/11821/0900766b80f806dd-11821735.pdf?src-supplier=RSComponents; ComponentLink4URL: https://datasheet.ciiva.com/36526/1989607-36526237.pdf?src-supplier=Jameco; ComponentLink4Description: https://datasheet.ciiva.com/36526/1989607-36526237.pdf?src-supplier=Jameco; ComponentLink5URL: https://datasheet.ciiva.com/28695/1678796-28695877.pdf?src-supplier=Element14; ComponentLink5Description: https://datasheet.ciiva.com/28695/1678796-28695877.pdf?src-supplier=Element14; ComponentLink6URL: https://datasheet.ciiva.com/43460/1678796-43460073.pdf?src-supplier=Farnell; ComponentLink6Description: https://datasheet.ciiva.com/43460/1678796-43460073.pdf?src-supplier=Farnell; ComponentLink7URL: https://datasheet.ciiva.com/9117/aoa0000ce1-9117354.pdf?src-supplier=Avnet; ComponentLink7Description: https://datasheet.ciiva.com/9117/aoa0000ce1-9117354.pdf?src-supplier=Avnet; ComponentLink8URL: https://datasheet.ciiva.com/46377/1678796-46377866.pdf?src-supplier=Element14; ComponentLink8Description: https://datasheet.ciiva.com/46377/1678796-46377866.pdf?src-supplier=Element14; ComponentLink9URL: https://datasheet.ciiva.com/17215/aoa0000ce1-17215390.pdf?src-supplier=Avnet+Europe; ComponentLink9Description: https://datasheet.ciiva.com/17215/aoa0000ce1-17215390.pdf?src-supplier=Avnet+Europe; ComponentLink10URL: https://datasheet.ciiva.com/16512/aoa0000ce1-16512111.pdf?src-supplier=Avnet+Asia; ComponentLink10Description: https://datasheet.ciiva.com/16512/aoa0000ce1-16512111.pdf?src-supplier=Avnet+Asia; Supplier 2: LCSC; Supplier Part Number 2: C169855
R6 R7 = CMP-2001-00334-1: Part Number: ERJ-6GEYJ100V; Manufacturer: Panasonic; Resistance: 10R; Tolerance: 5%; Temperature Coefficient: 200ppm/°C; Power Rating: 125mW; Voltage Rating: 150V; Supplier 1: LCSC; Supplier Part Number 1: C413144; Manufacturer Part Number: ERJ-6GEYJ100V; RoHS: Yes; Category: Chip SMD Resistors; Stock 1: 1750; Pricing 1: 50=0.00990, 500=0.00720, 1500=0.00670, 5000=0.00630, 25000=0.00600, 50000=0.00590, 50=0.00950, 500=0.00690, 1500=0.00640, 5000=0.00600, 25000=0.00580, 50000=0.00570, 50=0.04940, 500=0.03610, 1500=0.03370, 5000=0.03120, 25000=0.03010, 50000=0.02960, 50=0.04490, 500=0.03280, 1500=0.03060, 5000=0.02840, 25000=0.02740, 50000=0.02690, 50=0.00600, 500=0.00440, 1500=0.00410, 5000=0.00380, 25000=0.00370, 50000=0.00360, 50=0.00550, 500=0.00400, 1500=0.00370, 5000=0.00350, 25000=0.00340, 50000=0.00330, 50=0.05470, 500=0.04000, 1500=0.03730, 5000=0.03460, 25000=0.03340, 50000=0.03280, 50=0.74590, 500=0.54520, 1500=0.50830, 5000=0.47140, 25000=0.45500, 50000=0.44690, 50=0.03000, 500=0.02190, 1500=0.02050, 5000=0.01900, 25000=0.01830, 50000=0.01800, 50=0.50570, 500=0.36960, 1500=0.34460, 5000=0.31960, 25000=0.30850, 50000=0.30300, 50=0.06210, 500=0.04540, 1500=0.04230, 5000=0.03930, 25000=0.03790, 50000=0.03720, 50=0.00970, 500=0.00710, 1500=0.00660, 5000=0.00620, 25000=0.00590, 50000=0.00580, 50=0.00706, 500=0.00516, 1500=0.00481, 5000=0.00446, 25000=0.00431, 50000=0.00423 (AUD); Mount: Surface Mount; Case/Package: 0805; Case Code (Metric): 2012; Case Code (Imperial): 0805; Contact Plating: Tin; Min Operating Temperature: -55°C; Max Operating Temperature: 155°C; Packaging: Tape and Reel; Composition: Thick Film; Termination: SMD/SMT; Package Quantity: 5000; Voltage Rating (DC): 150V; Number of Terminations: 2; Max Power Dissipation: 125mW; Military Standard: Not; Working Voltage: 150V; Length: 2mm; Height: 0.6mm; Width: 0.049inch; Depth: 1.25mm; Radiation Hardening: No; Lead Free: Lead Free; REACH SVHC: No SVHC; ComponentLink1URL: https://datasheet.ciiva.com/11821/0900766b80f806dd-11821499.pdf?src-supplier=RSComponents; ComponentLink1Description: https://datasheet.ciiva.com/11821/0900766b80f806dd-11821499.pdf?src-supplier=RSComponents; ComponentLink2URL: https://datasheet.ciiva.com/34303/1989615-34303646.pdf?src-supplier=Jameco; ComponentLink2Description: https://datasheet.ciiva.com/34303/1989615-34303646.pdf?src-supplier=Jameco; ComponentLink3URL: https://datasheet.ciiva.com/15158/getdatasheetpartid-247141-15158885.pdf?src-supplier=Verical; ComponentLink3Description: https://datasheet.ciiva.com/15158/getdatasheetpartid-247141-15158885.pdf?src-supplier=Verical; ComponentLink4URL: https://datasheet.ciiva.com/17212/aoa0000ce1-17212058.pdf?src-supplier=Avnet+Europe; ComponentLink4Description: https://datasheet.ciiva.com/17212/aoa0000ce1-17212058.pdf?src-supplier=Avnet+Europe; ComponentLink5URL: https://datasheet.ciiva.com/16775/70255313-16775163.pdf?src-supplier=Allied+Electronics; ComponentLink5Description: https://datasheet.ciiva.com/16775/70255313-16775163.pdf?src-supplier=Allied+Electronics; ComponentLink6URL: https://datasheet.ciiva.com/16788/70255313-16788828.pdf?src-supplier=Allied+Electronics; ComponentLink6Description: https://datasheet.ciiva.com/16788/70255313-16788828.pdf?src-supplier=Allied+Electronics; ComponentLink7URL: https://datasheet.ciiva.com/46388/1500035-46388637.pdf?src-supplier=Element14; ComponentLink7Description: https://datasheet.ciiva.com/46388/1500035-46388637.pdf?src-supplier=Element14; ComponentLink8URL: https://datasheet.ciiva.com/9117/aoa0000ce1-9117358.pdf?src-supplier=Avnet; ComponentLink8Description: https://datasheet.ciiva.com/9117/aoa0000ce1-9117358.pdf?src-supplier=Avnet; ComponentLink9URL: https://datasheet.ciiva.com/43460/1500035-43460079.pdf?src-supplier=Farnell; ComponentLink9Description: https://datasheet.ciiva.com/43460/1500035-43460079.pdf?src-supplier=Farnell; Supplier 2: Digi-Key; Supplier Part Number 2: P10ACT-ND; Stock 2: 34341; Pricing 2: 1=0.10000, 10=0.05400, 100=0.02210, 1000=0.00991, 2500=0.00860 (USD)
SJ1 = Switchable Jumper: Switchable Solder Jumper to choose between two connections.
SW1 = CMP-05618-000006-1: SWITCH TACTILE SPST-NO 0.02A 15V; Manufacturer: Panasonic Electronic Components; Operating Force: 2.6N; Contact Resistance: 50mΩ; Contact Current Rating: 20mA; Electromechanical Life: 200000Cycles; Illumination Type: Non-Illuminated,Illuminated; Switch Function: Off-Mom; Actuator Type: Standard; Switch Travel: 0.25mm; Insulation Resistance: 50MR; Actuator Length: 0.3mm; Throw Configuration: SPST-NO; Automotive: No; Digikey Description: SWITCH TACTILE SPST-NO 0.02A 15V; Device Class L3: Tactile Switches; Device Class L2: Switches; Temperature Range Low: -20°C; ComponentLink2Description: Datasheet; RoHS: TRUE; Mount: Surface Mount; Package: 0; Height: 1.7mm; Octopart: https://octopart.com/evq-plma15-panasonic-39850235; Temperature Range High: +70°C; Device Class L1: Electromechanical; Category: Switch; Mouser Description: Tactile Switches FLAT ACT 2.6NF 4.6x3.4x1.5mm; Voltage Rating Dc: 15V; Manufacturer Part Number: EVQ-PLMA15; ComponentLink2URL: https://datasheet.ciiva.com/8164/atv0000ce2-8164994.pdf; Lead Free: Yes; Temperature: -20°C to +70°C; Supplier 1: Digi-Key; Supplier Part Number 1: P8047SCT-ND; Stock 1: 10270; Pricing 1: 1=0.40000, 10=0.38500, 25=0.36200, 100=0.31440, 250=0.28520, 500=0.26532, 1000=0.23879, 2500=0.22420 (USD); Mechanical Life: 200000Cycles; Contact Plating: Gold,Silver; Min Operating Temperature: -20°C; Max Operating Temperature: 70°C; Packaging: Tape and Reel; Termination: J-Bend; Package Quantity: 1; Max Voltage Rating (DC): 15V; Orientation: Straight; Voltage Rating (DC): 15V; Current Rating: 20mA; Max Current Rating: 20mA; Electrical Life: 200000Cycles; Voltage Rating: 15V; Length: 4.9mm; Depth: 4.9mm; Width: 4.9mm; Radiation Hardening: No; REACH SVHC: No SVHC; ComponentLink1URL: https://datasheet.ciiva.com/8164/atv0000ce2-8164994.pdf?src-supplier=Avnet; ComponentLink1Description: https://datasheet.ciiva.com/8164/atv0000ce2-8164994.pdf?src-supplier=Avnet; ComponentLink3URL: https://datasheet.ciiva.com/16205/atk0000ce3-16205767.pdf?src-supplier=Future+Electronics; ComponentLink3Description: https://datasheet.ciiva.com/16205/atk0000ce3-16205767.pdf?src-supplier=Future+Electronics; ComponentLink4URL: https://datasheet.ciiva.com/17065/70270715-17065721.pdf?src-supplier=Allied+Electronics; ComponentLink4Description: https://datasheet.ciiva.com/17065/70270715-17065721.pdf?src-supplier=Allied+Electronics; ComponentLink5URL: https://datasheet.ciiva.com/2899/atk0000ce3-2899834.pdf?src-supplier=Digi-Key; ComponentLink5Description: https://datasheet.ciiva.com/2899/atk0000ce3-2899834.pdf?src-supplier=Digi-Key; ComponentLink6URL: https://datasheet.ciiva.com/2899/atk0000ce3-2899835.pdf?src-supplier=Digi-Key; ComponentLink6Description: https://datasheet.ciiva.com/2899/atk0000ce3-2899835.pdf?src-supplier=Digi-Key; ComponentLink7URL: https://datasheet.ciiva.com/2899/atk0000ce3-2899836.pdf?src-supplier=Digi-Key; ComponentLink7Description: https://datasheet.ciiva.com/2899/atk0000ce3-2899836.pdf?src-supplier=Digi-Key; ComponentLink8URL: https://datasheet.ciiva.com/26827/getdatasheetpartid-51835-26827884.pdf?src-supplier=Verical; ComponentLink8Description: https://datasheet.ciiva.com/26827/getdatasheetpartid-51835-26827884.pdf?src-supplier=Verical; Supplier 2: LCSC; Supplier Part Number 2: C128538; Stock 2: 6341; Pricing 2: 1=0.21800, 10=0.16260, 30=0.15240, 100=0.14220, 500=0.13770, 1000=0.13540, 1=0.20310, 10=0.15140, 30=0.14190, 100=0.13250, 500=0.12830, 1000=0.12620, 1=1.05930, 10=0.78990, 30=0.74040, 100=0.69100, 500=0.66900, 1000=0.65800, 1=0.99140, 10=0.73930, 30=0.69290, 100=0.64670, 500=0.62610, 1000=0.61590, 1=0.13300, 10=0.09920, 30=0.09290, 100=0.08670, 500=0.08400, 1000=0.08260, 1=0.11920, 10=0.08890, 30=0.08330, 100=0.07780, 500=0.07530, 1000=0.07410, 1=1.15780, 10=0.86330, 30=0.80920, 100=0.75520, 500=0.73120, 1000=0.71920, 1=15.95070, 10=11.89420, 30=11.14850, 100=10.40450, 500=10.07330, 1000=9.90850, 1=0.63950, 10=0.47690, 30=0.44700, 100=0.41720, 500=0.40390, 1000=0.39730, 1=10.41900, 10=7.76930, 30=7.28220, 100=6.79620, 500=6.57990, 1000=6.47220, 1=1.39620, 10=1.04110, 30=0.97580, 100=0.91070, 500=0.88170, 1000=0.86730, 1=0.20830, 10=0.15540, 30=0.14560, 100=0.13590, 500=0.13160, 1000=0.12940, 1=0.14939, 10=0.11140, 30=0.10441, 100=0.09744, 500=0.09434, 1000=0.09280 (AUD)